# EAGLE design shrew-lite (EAGLE 7.6.0)
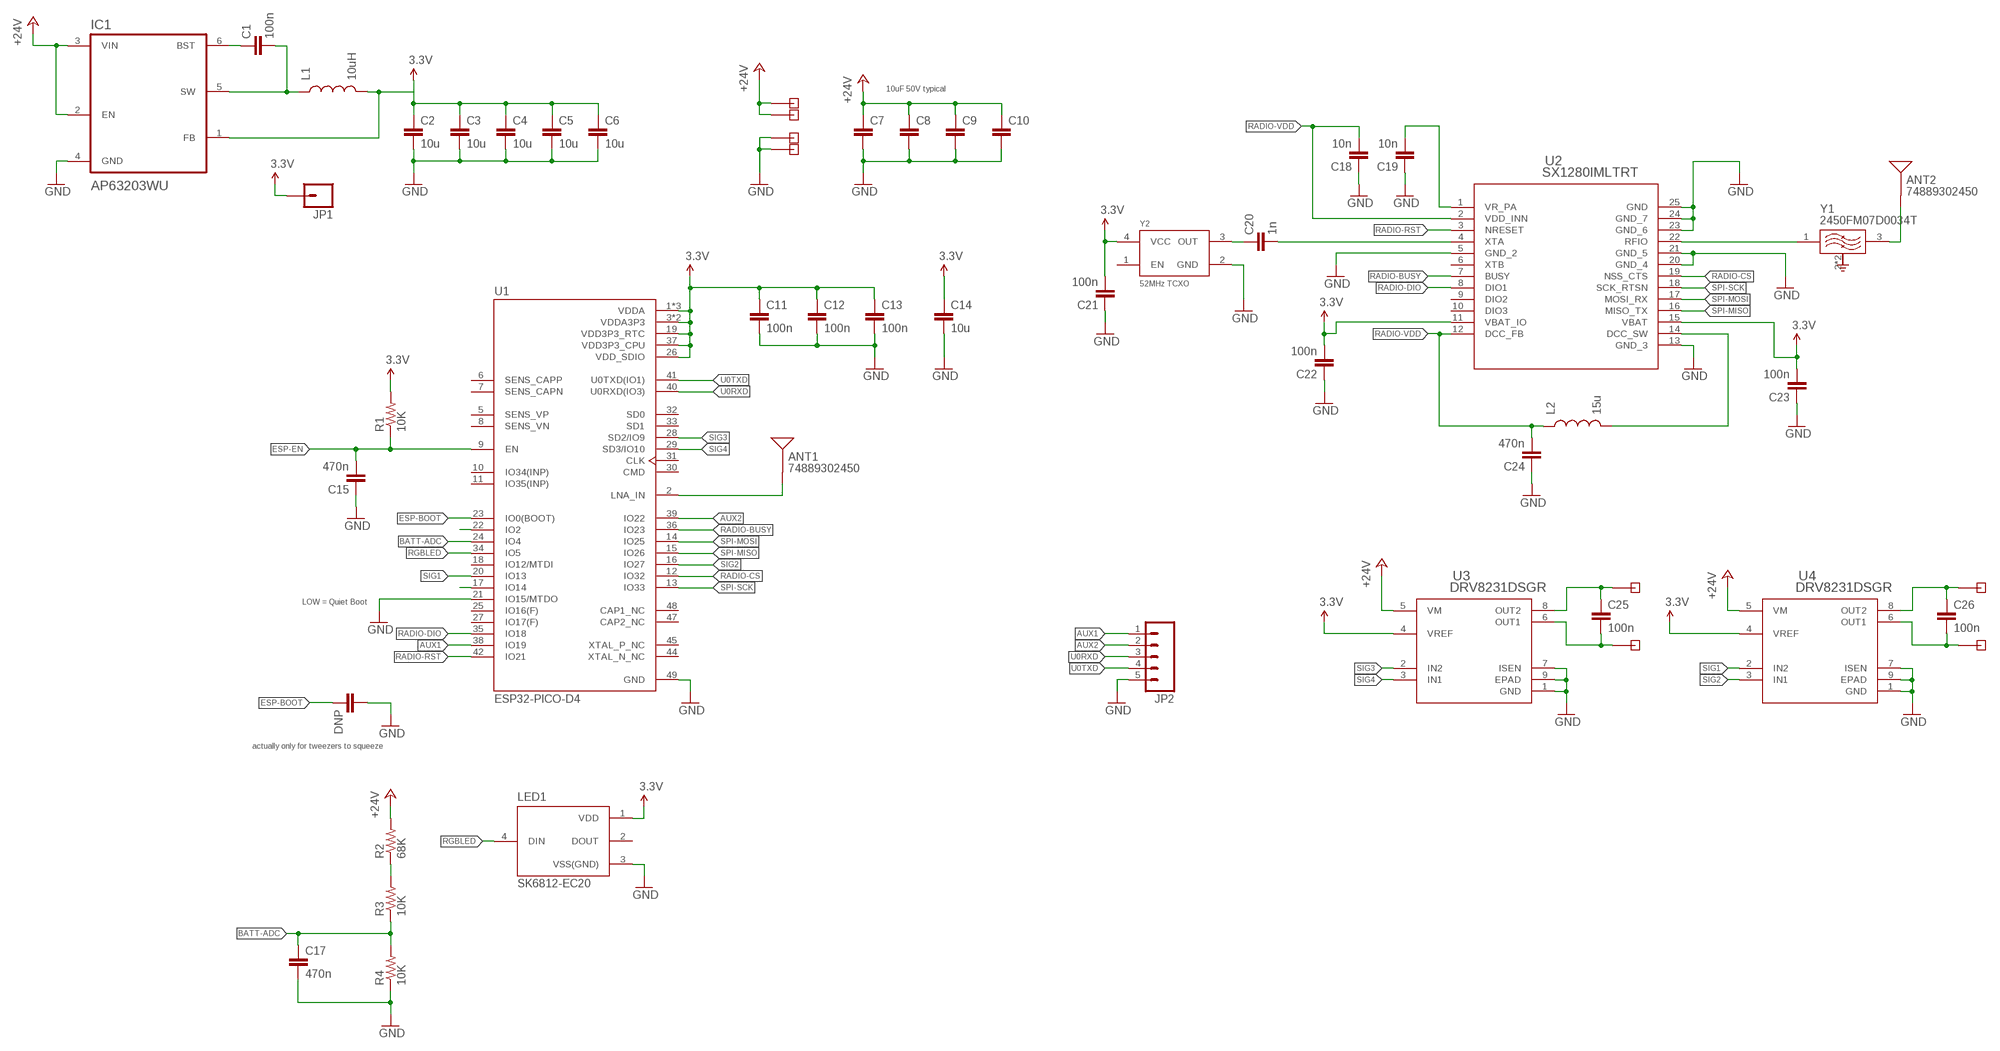
[diagram p0: schematic, sheet 1]

## Parts
ANT1  74889302450  ANTENNA2SMD  [ANTENNA-CHIP2]
ANT2  74889302450  ANTENNA2SMD  [ANTENNA-CHIP2]
C1  100n  CAP0402-REV  [0402-REV]
C2  10u  CAP0402-REV  [0402-REV]
C3  10u  CAP0402-REV  [0402-REV]
C4  10u  CAP0402-REV  [0402-REV]
C5  10u  CAP0402-REV  [0402-REV]
C6  10u  CAP0402-REV  [0402-REV]
C7  10u  CAP0805  [0805]
C8  10u  CAP0805  [0805]
C9  10u  CAP0805  [0805]
C10  10u  CAP0805  [0805]
C11  100n  CAP0402-REV  [0402-REV]
C12  100n  CAP0402-REV  [0402-REV]
C13  100n  CAP0402-REV  [0402-REV]
C14  10u  CAP0402-REV  [0402-REV]
C15  470n  CAP0402-REV  [0402-REV]
C16  DNP  CAP0402-CAP  [0402-CAP]
C17  470n  CAP0402-REV  [0402-REV]
C18  10n  CAP0402-REV  [0402-REV]
C19  10n  CAP0402-REV  [0402-REV]
C20  1n  CAP0402-REV  [0402-REV]
C21  100n  CAP0402-REV  [0402-REV]
C22  100n  CAP0402-REV  [0402-REV]
C23  100n  CAP0402-REV  [0402-REV]
C24  470n  CAP0402-REV  [0402-REV]
C25  100n  CAP0402-CAP  [0402-CAP]
C26  100n  CAP0402-CAP  [0402-CAP]
IC1  AP63203WU  [SOT95P280X110-6N]
JP1  M01-1.0MM-TP  [1X01-1.0MM-TP]
JP2  M05PTH  [1X05]
L1  10uH  INDUCTOR0805  [0805]
L2  15u  INDUCTOR0805  [0805]
LED1  SK6812-EC20  [SK6812-EC20]
R1  10K  RESISTOR0402-REV  [0402-REV]
R2  68K  RESISTOR0402-REV  [0402-REV]
R3  10K  RESISTOR0402-REV  [0402-REV]
R4  10K  RESISTOR0402-REV  [0402-REV]
U1  ESP32-PICO-D4  [PQFN50P700X700X104-49N]
U2  SX1280IMLTRT  [QFN24_4X4_SEM]
U3  DRV8231DSGR  [WSON8_DRV8231_TEX]
U4  DRV8231DSGR  [WSON8_DRV8231_TEX]
X1  PIN-1X-MED  [PAD-1X-MED]
X2  PIN-1X-MED  [PAD-1X-MED]
X3  PIN-1X-MED  [PAD-1X-MED]
X4  PIN-1X-MED  [PAD-1X-MED]
X5  PIN-1X-BIG  [PAD-1X-BIG]
X6  PIN-1X-BIG  [PAD-1X-BIG]
X7  PIN-1X-BIG  [PAD-1X-BIG]
X8  PIN-1X-BIG  [PAD-1X-BIG]
Y1  2450FM07D0034T  [FIL_2450FM07D0034T]
Y2  52MHz TCXO  OSCILLATOR-TG2016SMN  [OSC_TG2016SMN_50.0000M-ECGNNMB]

## Nets
3.3V: C2.1 C3.1 C4.1 C5.1 C6.1 C11.1 C12.1 C13.1 C14.1 C21.2 C22.2 C23.2 IC1.1(FB) JP1.1 L1.2 LED1.1(VDD) R1.2 U1.1(VDDA) U1.3(VDDA3P3) U1.4(VDDA3P3) U1.19(VDD3P3_RTC) U1.26(VDD_SDIO) U1.37(VDD3P3_CPU) U1.43(VDDA) U1.46(VDDA) U2.11(VBAT_IO) U2.15(VBAT) U3.4(VREF) U4.4(VREF) Y2.4(VCC)
+24V: C7.1 C8.1 C9.1 C10.1 IC1.2(EN) IC1.3(VIN) R2.2 U3.5(VM) U4.5(VM) X1.1 X2.1
AUX1: JP2.1 U1.38(IO19)
AUX2: JP2.2 U1.39(IO22)
BATT-ADC: C17.1 R3.1 R4.2 U1.24(IO4)
ESP-BOOT: C16.2 U1.23(IO0(BOOT))
ESP-EN: C15.2 R1.1 U1.9(EN)
GND: C2.2 C3.2 C4.2 C5.2 C6.2 C7.2 C8.2 C9.2 C10.2 C11.2 C12.2 C13.2 C14.2 C15.1 C16.1 C17.2 C18.1 C19.1 C21.1 C22.1 C23.1 C24.1 IC1.4(GND) JP2.5 LED1.3(VSS(GND)) R4.1 U1.21(IO15/MTDO) U1.49(GND) U2.5(GND_2) U2.13(GND_3) U2.20(GND_4) U2.21(GND_5) U2.23(GND_6) U2.24(GND_7) U2.25(GND) U3.1(GND) U3.7(ISEN) U3.9(EPAD) U4.1(GND) U4.7(ISEN) U4.9(EPAD) X3.1 X4.1 Y2.2(GND)
MOTOR1: C26.2 U4.6(OUT1) X8.1
MOTOR2: C26.1 U4.8(OUT2) X6.1
MOTOR3: C25.2 U3.6(OUT1) X7.1
MOTOR4: C25.1 U3.8(OUT2) X5.1
N$1: ANT1.FEED(SIGNAL) U1.2(LNA_IN)
N$2: C20.1 Y2.3(OUT)
N$3: C20.2 U2.4(XTA)
N$4: R2.1 R3.2
N$5: U1.17(IO14)
N$6: U2.22(RFIO) Y1.1(IN)
N$7: ANT2.FEED(SIGNAL) Y1.3(OUT)
N$8: U1.22(IO2)
N$9: L2.2 U2.14(DCC_SW)
N$10: C1.2 IC1.5(SW) L1.1
N$11: C19.2 U2.1(VR_PA)
N$12: C1.1 IC1.6(BST)
RADIO-BUSY: U1.36(IO23) U2.7(BUSY)
RADIO-CS: U1.12(IO32) U2.19(NSS_CTS)
RADIO-DIO: U1.35(IO18) U2.8(DIO1)
RADIO-RST: U1.42(IO21) U2.3(NRESET)
RADIO-VDD: C18.2 C24.2 L2.1 U2.2(VDD_INN) U2.12(DCC_FB)
RGBLED: LED1.4(DIN) U1.34(IO5)
SIG1: U1.20(IO13) U4.2(IN2)
SIG2: U1.16(IO27) U4.3(IN1)
SIG3: U1.28(SD2/IO9) U3.2(IN2)
SIG4: U1.29(SD3/IO10) U3.3(IN1)
SPI-MISO: U1.15(IO26) U2.16(MISO_TX)
SPI-MOSI: U1.14(IO25) U2.17(MOSI_RX)
SPI-SCK: U1.13(IO33) U2.18(SCK_RTSN)
U0RXD: JP2.3 U1.40(U0RXD(IO3))
U0TXD: JP2.4 U1.41(U0TXD(IO1))
Unconnected: LED1.2(DOUT) U1.5(SENS_VP) U1.6(SENS_CAPP) U1.7(SENS_CAPN) U1.8(SENS_VN) U1.10(IO34(INP)) U1.11(IO35(INP)) U1.18(IO12/MTDI) U1.25(IO16(F)) U1.27(IO17(F)) U1.30(CMD) U1.31(CLK) U1.32(SD0) U1.33(SD1) U1.44(XTAL_N_NC) U1.45(XTAL_P_NC) U1.47(CAP2_NC) U1.48(CAP1_NC) U2.6(XTB) U2.9(DIO2) U2.10(DIO3) Y2.1(EN)

## Notes on the sheet
- 10uF 50V typical
- LOW = Quiet Boot
- actually only for tweezers to squeeze

## Power pins joined to a net without a drawn wire
GND: Y1.2(GND) Y1.4(GND)

## Library data of the parts
ANT1 ANT2 = shrew-common:ANTENNA2: Antenna Single endded antenna. Common with smaller chip antennas. CHIP4 package is the GPS Chip Antenna SKU: GPS-08418. CHIP5 package is 2.4GHz chip antenna SKU: WRL-00144.
C1-C26 = shrew-common:CAP: Capacitor Standard 0603 ceramic capacitor, and 0.1" leaded capacitor.
IC1 = shrew-core:AP63203WU: Check availability <https://pricing.snapeda.com/parts/LMR16006XDDCR/Texas%20Instruments/view-part?ref=eda>; PACKAGE: SOT-23-THN-6 Texas Instruments
JP1 = shrew-common:M01: Header 1 Standard 1-pin 0.1" header. Use with straight break away headers (SKU : PRT-00116), right angle break away headers (PRT-00553), swiss pins (PRT-00743), machine pins (PRT-00117), and female headers (PRT-00115).
JP2 = shrew-common:M05: Header 5 Standard 5-pin 0.1" header. Use with straight break away headers (SKU : PRT-00116), right angle break away headers (PRT-00553), swiss pins (PRT-00743), machine pins (PRT-00117), and female headers (PRT-00115). Molex polarized connector foot print use with SKU : PRT-08230 with associated crimp pins and housings.
L1 L2 = shrew-common:INDUCTOR: Inductors Basic Inductor/Choke - 0603 and 1206. Footprints are not proven and vary greatly between part numbers.
LED1 = shrew-core:SK6812: SMD 5050 Full color RGB LED data transmission frequency up to 800Kbps, with 30 fps refresh rate, 5.00x5.00 mm Check availability <https://pricing.snapeda.com/parts/SK6812/Shenzhen%20LED%20Color%20Optoelectronic%20Inc./view-part?ref=eda>
R1-R4 = shrew-common:RESISTOR: Resistor Basic schematic elements and footprints for 0603, 1206, and PTH resistors.
U1 = shrew-core:ESP32-PICO-D4: Bluetooth, WiFi 802.11b/g/n, Bluetooth v4.2 +EDR, Class 1, 2 and 3 Transceiver Module 2.4GHz ~ 2.5GHz Surface Mount Check availability <https://pricing.snapeda.com/parts/ESP32-PICO-D4/Espressif%20Systems/view-part?ref=eda>; AVAILABILITY: In Stock; CHECK_PRICES: https://www.snapeda.com/parts/ESP32-PICO-D4/Espressif+Systems/view-part/?ref=eda; DESCRIPTION: Bluetooth, WiFi 802.11b/g/n, Bluetooth v4.2 +EDR, Class 1, 2 and 3 Transceiver Module 2.4GHz ~ 2.5GHz - Surface Mount; MF: Espressif Systems; MP: ESP32-PICO-D4; PACKAGE: SMD-48 Espressif Systems; PRICE: None; SNAPEDA_LINK: https://www.snapeda.com/parts/ESP32-PICO-D4/Espressif+Systems/view-part/?ref=snap
U2 = shrew-core:SX1280IMLTRT; COPYRIGHT: Copyright (C) 2024 Ultra Librarian. All rights reserved.; MANUFACTURER_PART_NUMBER: SX1280IMLTRT; MFR_NAME: Semtech
U3 U4 = shrew-core:DRV8231DSGR; COPYRIGHT: Copyright (C) 2024 Ultra Librarian. All rights reserved.; MANUFACTURER_PART_NUMBER: DRV8231DSGR; MFR_NAME: Texas Instruments
X1-X8 = shrew-core:PIN-1X
Y1 = shrew-core:2450FM07D0034T: 2.4GHz ~ 2.5GHz Frequency RF Filter (Radio Frequency) 100MHz Bandwidth 0.75dB 0402 (1005 Metric), 4 PC Pad Check availability <https://pricing.snapeda.com/parts/2450FM07D0034T/Johanson%20Technology%20Inc./view-part?ref=eda>; AVAILABILITY: In Stock; CHECK_PRICES: https://www.snapeda.com/parts/2450FM07D0034T/Johanson+Technology+Inc./view-part/?ref=eda; DESCRIPTION: 2.4GHz ~ 2.5GHz Frequency - RF Filter (Radio Frequency) 100MHz Bandwidth 0.75dB 0402 (1005 Metric), 4 PC Pad; MF: Johanson Technology Inc.; MP: 2450FM07D0034T; PACKAGE: 0402 Johanson Technology Inc.; PRICE: None; SNAPEDA_LINK: https://www.snapeda.com/parts/2450FM07D0034T/Johanson+Technology+Inc./view-part/?ref=snap
Y2 = shrew-common:OSCILLATOR

## Board
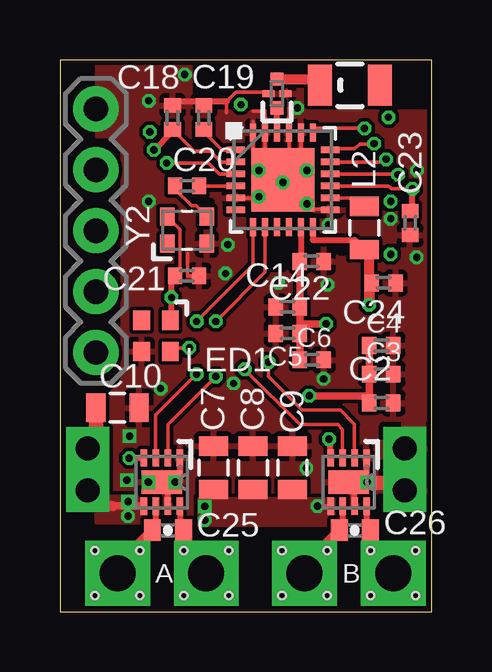
[diagram p1: board, top side]
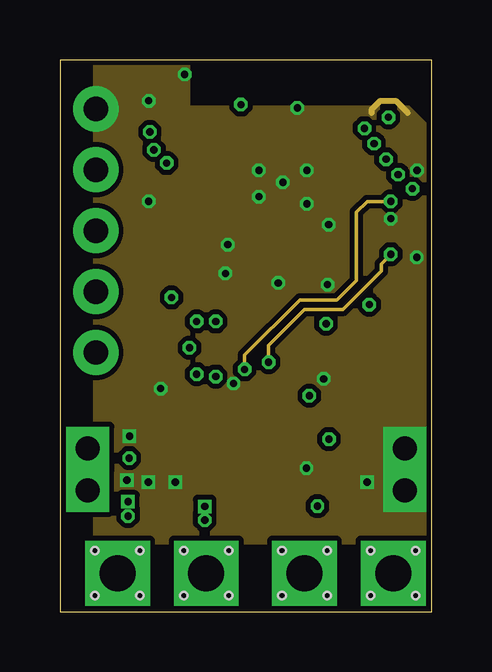
[diagram p2: board, inner layer Route2]
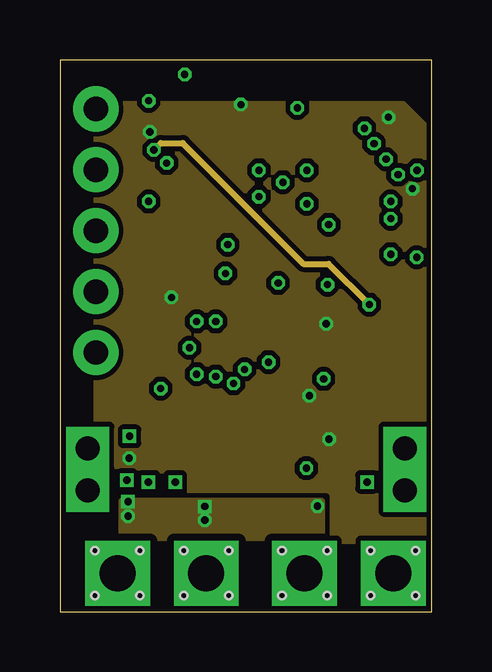
[diagram p3: board, inner layer Route15]
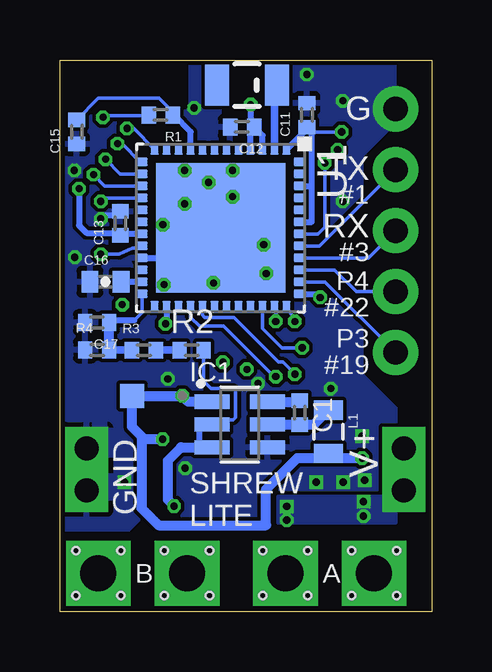
[diagram p4: board, bottom side, seen from below]

Size 15.5 x 23 mm. Coordinates in mm from the lower left corner, seen from the top.
Outline: 15.5,9 15.5,23 0,23 0,0 15.5,0 15.5,10
Copper layers (1+2*15+16): Top 0.035mm / dielectric 0.2mm / Route2 0.0175mm / dielectric 1.065mm / Route15 0.0175mm / dielectric 0.2mm / Bottom 0.035mm
Design rules "jlcpcb-4layers": minimum track width 3.5mil, minimum drill 0.2mm, track to track 5mil, track to pad 5mil, pad to pad 5mil, via to via 5mil, smd to smd 5mil, copper to edge 0.2mm, drill to drill 6mil, minimum pad ring 10mil, minimum via ring 0.13mm, stop-mask expansion 0.05mm, vias tented up to drill 16mil, thermal gap 8mil
tRestrict: area 11.1,21.1 to 12.9,22.8; area 5.7,21.1 to 8.6,23; area 12.9,21.1 to 15.3,22.8; 11 lines
bRestrict: area 10.3,21.1 to 13.9,22.8; 5 lines
vRestrict: area 10.3,21.1 to 13.9,22.8; area 5.7,21.4 to 9.5,23; area 13.9,21.1 to 15.3,22.8; 1 lines

### Footprints (pad centres in the part's own frame; a part is rotated, then mirrored left to right if it is on the bottom)
ANTENNA-CHIP2 = smd 1.7 x 1: ? 0,-1.25; FEED 0,1.25
0402-REV = smd 0.6 x 0.7: 1 -0.5,0; 2 0.5,0
0805 = smd 0.8 x 1.2: 1 -0.9,0; 2 0.9,0
0402-CAP = smd 0.7 x 0.9: 1 -0.65,0; 2 0.65,0
SOT95P280X110-6N = smd 1.45 x 0.59: 1 -1.155,0.95; 2 -1.155,0; 3 -1.155,-0.95; 4 1.155,-0.95; 5 1.155,0; 6 1.155,0.95
1X01-1.0MM-TP = smd 1 x 1: 1 0,0
1X05 = drill 1.016 pad 1.88: 1 0,0; 2 2.54,0; 3 5.08,0; 4 7.62,0; 5 10.16,0
SK6812-EC20 = smd 0.8 x 0.7: 1 0.65,-0.6; 2 0.65,0.6; 3 -0.65,0.6; 4 -0.65,-0.6
PQFN50P700X700X104-49N = smd 0.45 x 0.35: 1 -3.265,2.75; 2 -3.265,2.25; 3 -3.265,1.75; 4 -3.265,1.25; 5 -3.265,0.75; 6 -3.265,0.25; 7 -3.265,-0.25; 8 -3.265,-0.75; 9 -3.265,-1.25; 10 -3.265,-1.75; 11 -3.265,-2.25; 12 -3.265,-2.75; 25 3.265,-2.75; 26 3.265,-2.25; 27 3.265,-1.75; 28 3.265,-1.25; 29 3.265,-0.75; 30 3.265,-0.25; 31 3.265,0.25; 32 3.265,0.75; 33 3.265,1.25; 34 3.265,1.75; 35 3.265,2.25; 36 3.265,2.75 | smd 0.35 x 0.45: 13 -2.75,-3.265; 14 -2.25,-3.265; 15 -1.75,-3.265; 16 -1.25,-3.265; 17 -0.75,-3.265; 18 -0.25,-3.265; 19 0.25,-3.265; 20 0.75,-3.265; 21 1.25,-3.265; 22 1.75,-3.265; 23 2.25,-3.265; 24 2.75,-3.265; 37 2.75,3.265; 38 2.25,3.265; 39 1.75,3.265; 40 1.25,3.265; 41 0.75,3.265; 42 0.25,3.265; 43 -0.25,3.265; 44 -0.75,3.265; 45 -1.25,3.265; 46 -1.75,3.265; 47 -2.25,3.265; 48 -2.75,3.265 | smd 5.4 x 5.4: 49 0,0
QFN24_4X4_SEM = smd 0.762 x 0.254: 1 -1.968,1.25; 2 -1.968,0.75; 3 -1.968,0.25; 4 -1.968,-0.25; 5 -1.968,-0.75; 6 -1.968,-1.25; 13 1.968,-1.25; 14 1.968,-0.75; 15 1.968,-0.25; 16 1.968,0.25; 17 1.968,0.75; 18 1.968,1.25 | smd 0.254 x 0.762: 7 -1.25,-1.968; 8 -0.75,-1.968; 9 -0.25,-1.968; 10 0.25,-1.968; 11 0.75,-1.968; 12 1.25,-1.968; 19 1.25,1.968; 20 0.75,1.968; 21 0.25,1.968; 22 -0.25,1.968; 23 -0.75,1.968; 24 -1.25,1.968 | smd 2.642 x 2.642: 25 0,0
WSON8_DRV8231_TEX = smd 0.711 x 0.279: 1 -1.003,0.75; 2 -1.003,0.25; 3 -1.003,-0.25; 4 -1.003,-0.75; 5 1.003,-0.75; 6 1.003,-0.25; 7 1.003,0.25; 8 1.003,0.75 | smd 0.991 x 1.702: 9 0,0
PAD-1X-MED = drill 1 pad 1.8 square: 1 0,0
PAD-1X-BIG = drill 1.5 pad 2.5 square: 1 0,0 | hole 0.3: -0.94,0.94; 0.94,0.94; -0.94,-0.94; 0.94,-0.94
FIL_2450FM07D0034T = smd 0.55 x 0.55: 1 -0.6,0; 3 0.6,0 | smd 0.3 x 0.5: 2 0,-0.35; 4 0,0.35
OSC_TG2016SMN_50.0000M-ECGNNMB = smd 0.75 x 0.6: 1 -0.565,0.825; 2 -0.565,-0.825; 3 0.565,-0.825; 4 0.565,0.825

### Placement (x,y rotation side)
ANT1  7.7,21.95 270 bottom
ANT2  12.1,21.95 90 top
C1  5.5,8.3 270 bottom
C2  13.4,8.7 0 top
C3  13.4,9.9 0 top
C4  13.4,11.1 0 top
C5  9.5,11.6 180 top
C6  10.5,10.5 0 top
C7  6.4,6 90 top
C8  8.05,6 90 top
C9  9.7,6 90 top
C10  2.4,8.5 0 top
C11  5.2,20.7 90 bottom
C12  7.9,20.2 180 bottom
C13  12.98,16.18 90 bottom
C14  9.5,12.7 180 top
C15  14.8,20 90 bottom
C16  13.6,13.75 0 bottom
C17  13.95,12.05 180 bottom
C18  4.7,20.6 270 top
C19  6,20.6 270 top
C20  5.3,17.75 0 top
C21  5.3,14 180 top
C22  10.5,14.6 180 top
C23  14.6,16.2 90 top
C24  13.5,13.7 180 top
C25  4.5,3.39 180 top
C26  12.3,3.39 180 top
IC1  8,7.8 0 bottom
JP1  12.5,9 0 bottom
JP2  1.5,10.8 90 top
L1  4.3,7.5 270 bottom
L2  12.7,16 90 top
LED1  4,11.5 90 top
R1  11.3,20.7 180 bottom
R2  10.01,10.9 0 bottom
R3  12,10.9 0 bottom
R4  13.95,10.91 0 bottom
U1  8.8,16 270 bottom
U2  9.3,18 0 top
U3  4.25,5.4 270 top
U4  12.04,5.4 270 top
X1  1.16,6.8 0 top
X2  1.16,5.06 0 top
X3  14.39,5.06 0 top
X4  14.39,6.8 0 top
X5  6.1,1.6 0 top
X6  13.9,1.6 0 top
X7  2.4,1.6 0 top
X8  10.2,1.6 0 top
Y1  9.05,21.6 90 top
Y2  5.3,15.9 90 top

### Tracks (layer width: path | path; a pad name or v marks a point on that pad's centre or on a via)
3.3V  (via drill 0.3)
  Top 0.152: Y2.4 5.02,15.92 5.02,14 C21.2 | U2.15 13.7,17.75 13.82,17.63 v14.7,17.63
  Top 0.254: U2.11 10.05,14.9 C22.2 | 4.47,16.5 Y2.4 | LED1.1 4.65,12.2 v4.65,13.1 4.65,14 C21.2 | C23.2 14.7,16.7 v14.7,17.63 | U4.4 11.29,7.19 v11.22,7.19 | v2.89,6.4 U3.4
  Top 0.305: C22.2 C14.1 10,12 | v11.1,12 10,12 | 10,12 C5.1 C6.1 | v10.4,9 12.9,9 C2.1 C3.1 C4.1
  Bottom 0.152: v3.75,20 5,20 5.06,20 | v13.7,20.61 13.64,20.67 11.8,20.67 R1.2
  Bottom 0.254: U1.3 7.05,19.85 C12.1 | U1.4 7.55,19.9 C12.1 | v7.55,21.14 7.55,20.6 C12.1 | U1.1 5.26,20.05 C11.1 5,20.05 5,20 5,17.75 | U1.46 5,17.75 | U1.43 5,16.25 5,17.75 | U1.37 4.65,13.25 v4.65,13.1 | v14.7,17.63 14.7,16.1 14.39,15.79 12.98,15.79 C13.1 12.98,15.75 U1.19 | U1.26 11.05,12.05 v11.1,12
  Bottom 0.406: 5.59,6.4 4.3,6.4 | 4.3,6.4 v2.89,6.4 | 12.1,7.3 12.1,4.31 11.39,3.6 6.9,3.6 6.9,5.1 5.6,6.4 | 12.1,7.3 11.99,7.19 v11.22,7.19 | L1.2 4.3,6.4 | IC1.1 10.15,8.75 v10.4,9 JP1.1 | 12.1,7.3 12.5,7.7 12.5,8.7
  pour Route15 (isolate 0.203, rank 5, no thermals): 1.5,2.9 1.5,21.2 14.3,21.2 15.5,20 15.5,2.9
+24V  (via drill 0.3)
  Top 0.152: v10.74,4.4 U4.5
  Top 0.305: 2.2,4.4 U3.5
  Top 0.406: X2.1 1.9,4.46 2.2,4.4
  Top 0.61: X1.1 1.5,6.8 C10.1
  Bottom 0.152: R2.2 9.51,9.61 9.2,9.3 8.28,9.3 8.18,9.2 8.18,8.1 8.28,8 8.96,8 IC1.2
  Bottom 0.254: IC1.2 9.7,7.8 9.7,6.85
  Bottom 0.406: X1.1 X2.1 | v10.74,4.4 11,4.66 11,6.3 10.45,6.85 9.7,6.85 IC1.3
  other vias: 6.04,4.38 6.04,3.81 2.84,4.58 2.84,3.98
  pour Top (isolate 0.152, no thermals): 1.5,4.8 3.6,4.8 3.6,3.7 1.5,3.7
  pour Bottom (isolate 0.152, no thermals): 1.5,4.8 6.4,4.8 6.4,3.7 1.5,3.7
  pour Top (isolate 0.152, no thermals): 5.8,3.6 11.4,3.6 11.4,4.7 5.8,4.7
  pour Route15 (isolate 0.305, no thermals): 2.6,4.6 10.9,4.6 10.9,3.1 2.6,3.1
AUX1
  Bottom 0.152: U1.38 4.45,13.75 JP2.1
AUX2
  Bottom 0.152: U1.39 4.05,14.25 3.14,13.34 JP2.2
BATT-ADC
  Bottom 0.152: 12.4,12.14 12.06,12.47 U1.24
  Bottom 0.254: 12.4,12.14 13.45,12.14 C17.1
  Bottom 0.305: R3.1 R4.2
  Bottom 0.406: R4.2 C17.1
ESP-BOOT
  Bottom 0.152: C16.2 12.9,13.75
  Bottom 0.254: U1.23 12.9,13.75
ESP-EN
  Bottom 0.152: C15.2 13.9,21.4 11.36,21.4 10.8,20.84 R1.1
  Bottom 0.254: U1.9 10.05,20 10.75,20.7 R1.1
GND  (via drill 0.3)
  Top 0.152: v9.9,21 9.55,21 U2.21 | 5.33,14.93 5.33,14 5.69,14 | U2.5 9.3,17.25 U2.25 | 11.14,16.78 9.3,16.78 U2.25 | 10.05,19.79 10.05,18 U2.25 | U2.21 9.55,18 U2.25 | U2.25 8.55,18 U2.23 8.55,20.87 8.05,20.87 | 8.05,20.45 8.05,18 U2.25 | 8.74,21.66 7.34,21.66 6.95,21.27 6.95,20.8 | U2.21 9.55,18.4 v10.3,18.4 | 4.48,5.2 U3.9
  Top 0.254: 6.95,21.27 6,21.27 | 6,21.27 4.77,21.27 | C19.1 6,21.27 | U3.7 4.5,5.4 v4.81,5.4 5,5.4 U3.1 | U4.7 12.29,5.4 U4.9 12.79,5.4 U4.1
  Top 0.6: 14.4,5.36 12.7,5.36
  Route2 0.254: 13,20.8 13,20.94 13.36,21.3 14,21.3 14.5,20.8
  Bottom 0.152: U1.49 9.3,16.5 v9.3,17.9 | 13.8,7.3 13.8,6.8 X4.1
  Bottom 0.254: U1.21 11.16,14.75 v11.16,13.63 | C13.2 13.15,16.51 13.8,16.51 v13.8,16.38
  other vias: 11.21,16.13 14.88,14.77 8.3,18.4 8.3,17.3 10.3,17 7,15.3 6.9,14.1 3.7,17.1 3.7,21.3 5.2,22.4 14.9,18.4 9.1,13.7 2.79,5.48 3.69,5.4 2.9,7.31 10.28,5.98 12.81,5.4 7.24,9.51 11,9.7 4.2,9.3
  pour Top (isolate 0.152, rank 5): 1.5,2.3 1.5,8.5 2.6,9.6 2.6,19.5 1.5,20.6 1.5,23 15.5,23 15.5,2.3
  pour Bottom (isolate 0.152, rank 5): 1.5,3.4 1.5,8.5 2.9,9.9 2.9,19 1.5,20.4 1.5,23 15.5,23 15.5,3.4
  pour Route2 (isolate 0.203, no thermals): 1.5,2.9 1.5,23 5.3,23 5.3,21 14.5,21 15.5,20 15.5,2.9
  pour Top (isolate 0.152, no thermals): 1.5,23 1.5,19.8 2.8,19.8 2.8,23
  pour Bottom (isolate 0.152, no thermals): 1.5,23 2.9,23 2.9,19 1.5,20.4
  pour Bottom (isolate 0.152, no thermals): 13.1,6.5 15.2,6.5 14.1,6.9 14.1,8.2 13.6,8.2 13.6,7.6 13.2,7.6
  pour Top (isolate 0.152, no thermals): 13.2,7.1 13.2,6.4 15.2,6.4 15.2,8.1 14.3,8.1 14.3,7.1
  pour Bottom (isolate 0.152, no thermals): 13.2,5.7 13.2,4.7 15.1,4.7 15.1,5.7
MOTOR1
  Top 0.254: U4.6 11.79,3.39 C26.2
  Top 0.406: C26.2 10.2,1.94 X8.1
MOTOR2
  Top 0.254: U4.8 12.79,3.39 C26.1 12.95,1.6 X6.1
MOTOR3
  Top 0.254: U3.6 4,3.39 C25.2
  Top 0.406: C25.2 2.4,1.94 X7.1
MOTOR4
  Top 0.254: U3.8 5,3.39 C25.1 5.15,1.6 X5.1
N$1
  Bottom 0.305: U1.2 6.55,21.95 ANT1.FEED
N$2
  Top 0.152: Y2.3 5.67,16.92 5.48,16.92 4.8,17.6 C20.1
N$3
  Top 0.152: C20.2 U2.4
N$4
  Bottom 0.305: R2.1 R3.2
N$6
  Top 0.25: U2.22 Y1.1
N$7
  Top 0.406: Y1.3 10.85,22.2 ANT2.FEED
N$9
  Top 0.152: U2.14 12.3,17.25 L2.2
N$10
  Bottom 0.406: IC1.5 C1.2 4.9,7.8 L1.1
N$11
  Top 0.152: U2.1 6.75,19.25 6.05,19.95 C19.2
N$12
  Bottom 0.406: IC1.6 5.55,8.75 C1.1
RADIO-BUSY  (via drill 0.3)
  Top 0.152: U2.7 8.05,14.45 v5.7,12.1
  Bottom 0.152: v5.7,12.1 5.82,12.22 5.73,12.29 6.05,12.61 U1.36
RADIO-CS  (via drill 0.3)
  Top 0.152: v12.7,20.15 10.55,20.15 U2.19
  Bottom 0.152: U1.12 12.44,20.15 v12.7,20.15
RADIO-DIO  (via drill 0.3)
  Top 0.152: U2.8 8.55,14.15 v6.5,12.1
  Bottom 0.152: U1.35 6.5,12.73 v6.5,12.1
RADIO-RST  (via drill 0.3)
  Top 0.152: U2.3 6.65,18.25 6.2,18.7 v4.45,18.7
  Bottom 0.152: U1.42 4.74,15.75 4.45,16.04 v4.45,18.7
RADIO-VDD  (via drill 0.3)
  Top 0.152: U2.2 6.71,18.75 6.26,19.2 5.6,19.2 C18.2 4.7,19.97 4.64,19.97
  Top 0.254: 12.5,15.1 L2.1 12.3,15.5 10.55,15.5 U2.12 | v3.92,19.25 4.64,19.97
  Top 0.406: L2.1 12.9,15.1 v12.9,12.8 12.9,13.7 C24.2
  Route15 0.254: v3.92,19.25 4.2,19.53 5.12,19.53 10.15,14.5 11.2,14.5 v12.9,12.8
RGBLED  (via drill 0.3)
  Top 0.152: LED1.4 4.75,11 v5.4,11
  Bottom 0.152: v5.4,11 6.25,11 7.05,11.8 U1.34
SIG1  (via drill 0.3)
  Top 0.152: U4.2 12.29,7.8 11.69,8.4 10.1,8.4 8.7,9.8 v8.7,10.4
  Route2 0.152: v8.7,10.4 8.7,11.1 10.2,12.6 11.8,12.6 13.4,14.2 13.4,14.5 v13.8,14.9
  Bottom 0.152: v13.8,14.9 13.03,14.9 12.46,15.16 12.06,15.16 U1.20
SIG2  (via drill 0.3)
  Top 0.152: U4.3 11.79,7.6 11.59,7.8 10,7.8 v7.7,10.1
  Route2 0.152: v7.7,10.1 7.7,10.7 10,13 11.56,13 12.36,13.8 12.36,16.65 12.81,17.1 v13.8,17.1
  Bottom 0.152: U1.16 13.65,17.25 v13.8,17.1
SIG3  (via drill 0.3)
  Top 0.152: U3.2 4.5,7.1 4.5,7.8 v6.5,9.8
  Bottom 0.152: U1.28 10.05,12.27 9.68,11.9 8.68,11.9 6.58,9.8 v6.5,9.8
SIG4  (via drill 0.3)
  Top 0.152: U3.3 4,8.2 v5.7,9.9
  Bottom 0.152: U1.29 9.55,12.36 9.46,12.27 8.25,12.27 6.38,10.4 6.2,10.4 v5.7,9.9
SPI-MISO  (via drill 0.3)
  Top 0.152: U2.16 14.07,18.25 v14.1,18.22
  Bottom 0.152: U1.15 13.63,17.75 v14.1,18.22
SPI-MOSI  (via drill 0.3)
  Top 0.152: U2.17 13.49,18.75 v13.6,18.86
  Bottom 0.152: U1.14 12.99,18.25 v13.6,18.86
SPI-SCK  (via drill 0.3)
  Top 0.152: U2.18 11.55,19.25 11.6,19.3 12.29,19.3 12.5,19.5 v13.09,19.5 arc90 v13.1,19.51
  Bottom 0.152: U1.13 12.15,18.75 12.91,19.51 v13.1,19.51
U0RXD
  Bottom 0.152: U1.40 2.63,14.75 JP2.3
U0TXD
  Bottom 0.152: U1.41 4.67,15.25 JP2.4

### Text on the board
tPlace: A | B
bPlace: G | TX | #1 | RX | #3 | P4 | #22 | P3 | #19 | GND | V+ | SHREW / LITE | A | B